# EAGLE schematic SAME54-board (EAGLE 9.6.2)

## Sheet 1 of 2
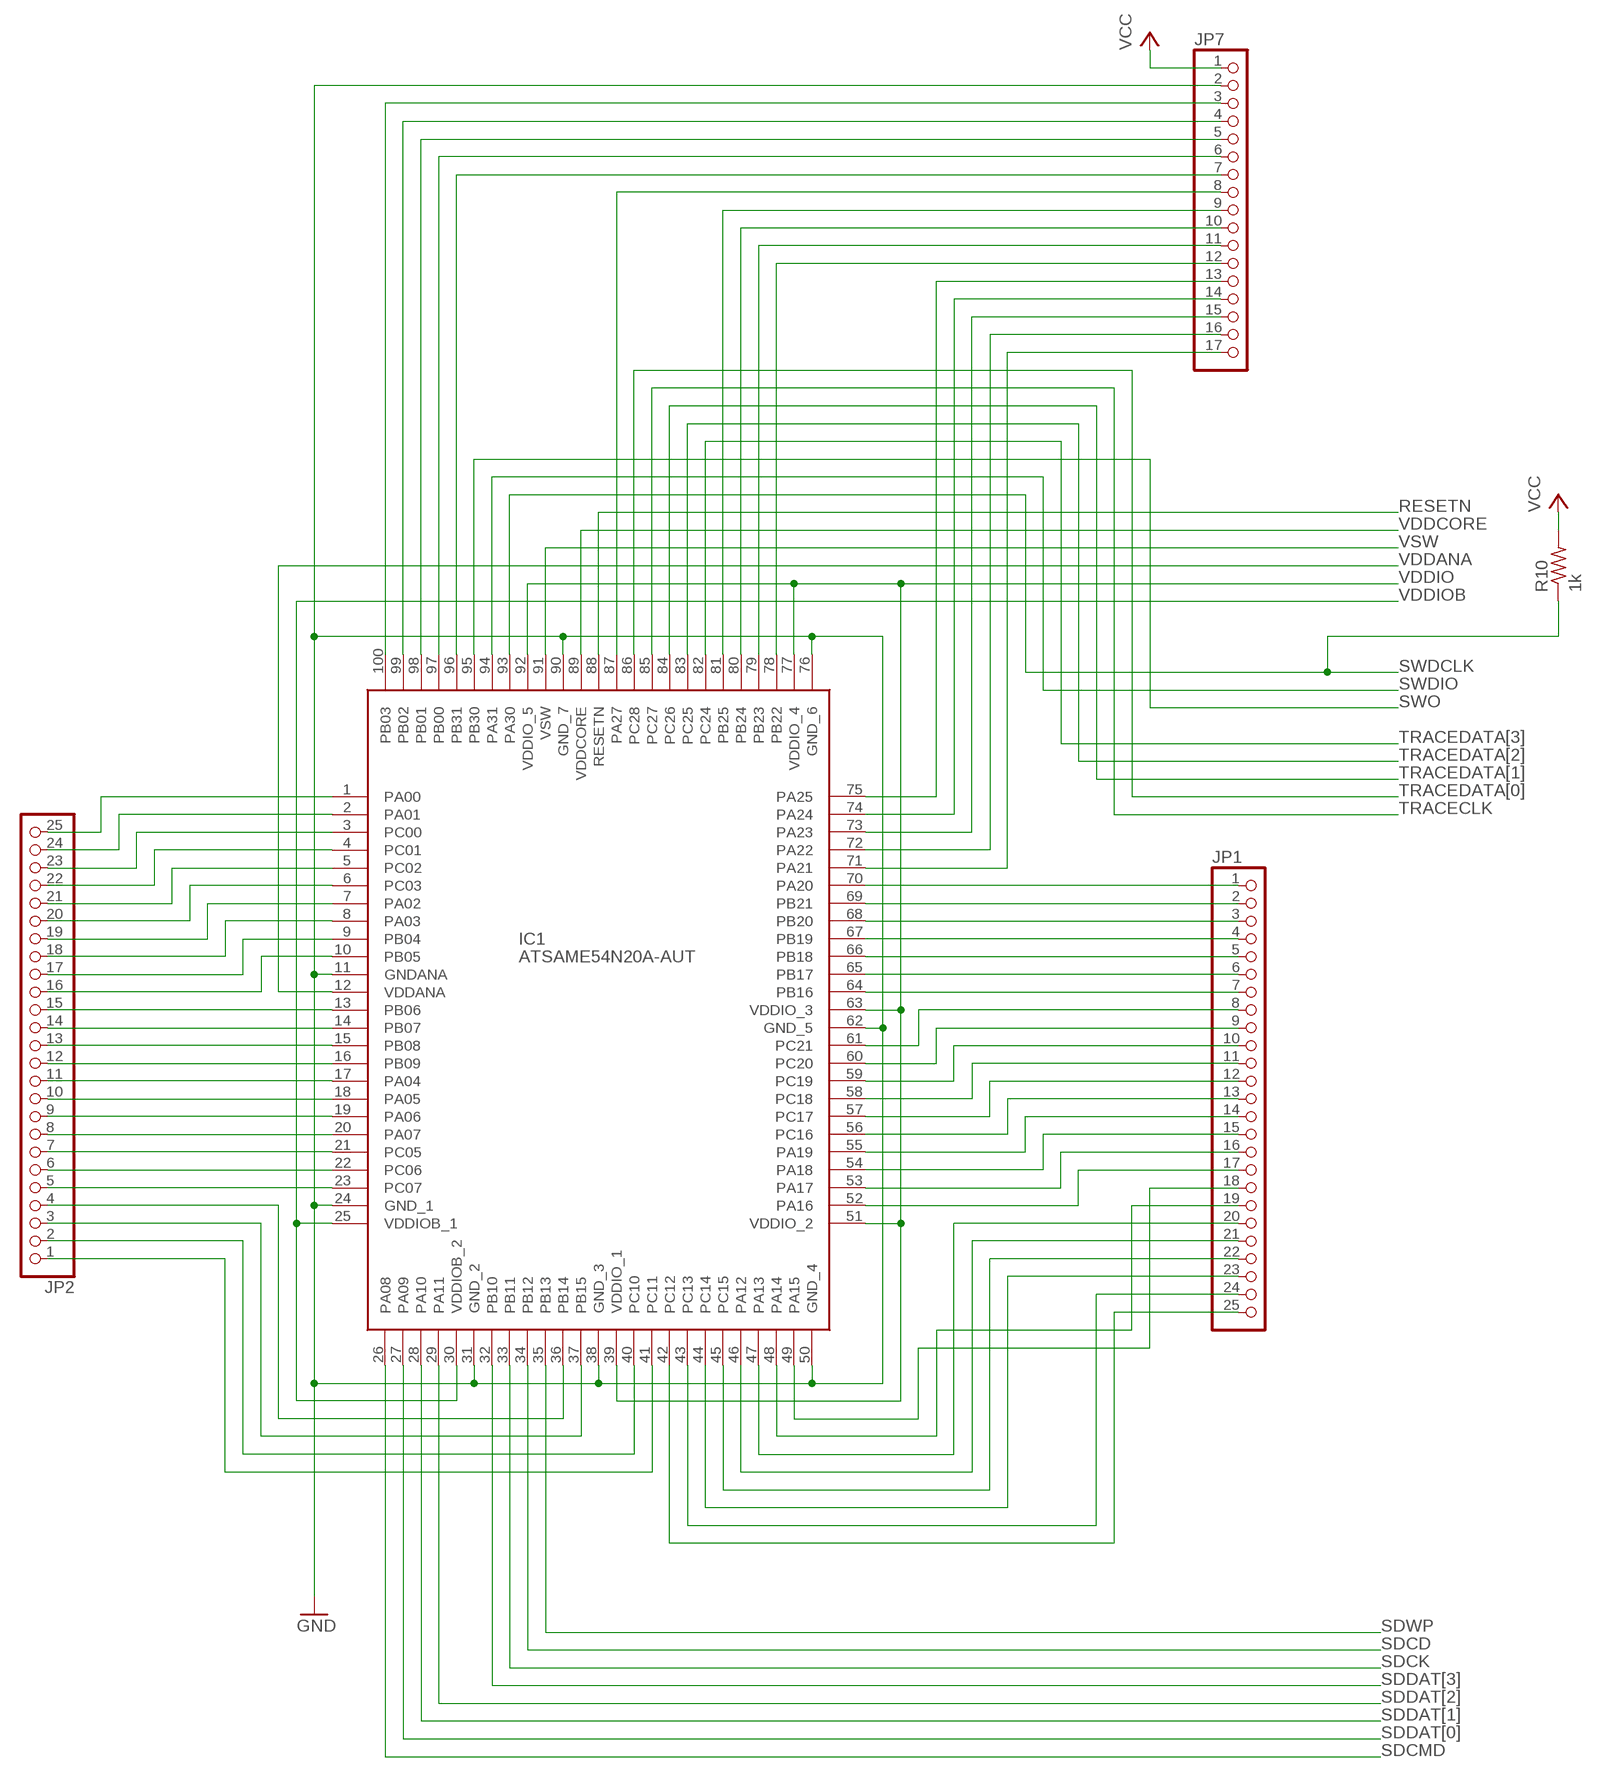
[diagram p0: schematic, sheet 1]

### Parts
IC1  ATSAME54N20A-AUT  [QFP50P1600X1600X120-100N]
JP1  PINHD-1X25  [1X25]
JP2  PINHD-1X25  [1X25]
JP7  PINHD-1X17  [1X17]
R10  1k  R-US_M1206  [M1206]

### Nets
GND: IC1.11(GNDANA) IC1.24(GND_1) IC1.31(GND_2) IC1.38(GND_3) IC1.50(GND_4) IC1.62(GND_5) IC1.76(GND_6) IC1.90(GND_7) JP7.2 ; also sheet 2
N$1: IC1.23(PC07) JP2.5
N$3: IC1.22(PC06) JP2.6
N$5: IC1.21(PC05) JP2.7
N$6: IC1.20(PA07) JP2.8
N$8: IC1.19(PA06) JP2.9
N$9: IC1.18(PA05) JP2.10
N$10: IC1.17(PA04) JP2.11
N$11: IC1.16(PB09) JP2.12
N$12: IC1.15(PB08) JP2.13
N$13: IC1.14(PB07) JP2.14
N$14: IC1.13(PB06) JP2.15
N$15: IC1.10(PB05) JP2.16
N$16: IC1.9(PB04) JP2.17
N$17: IC1.8(PA03) JP2.18
N$18: IC1.7(PA02) JP2.19
N$19: IC1.6(PC03) JP2.20
N$20: IC1.5(PC02) JP2.21
N$21: IC1.4(PC01) JP2.22
N$22: IC1.3(PC00) JP2.23
N$23: IC1.2(PA01) JP2.24
N$26: IC1.73(PA23) JP7.15
N$29: IC1.70(PA20) JP1.1
N$30: IC1.69(PB21) JP1.2
N$31: IC1.68(PB20) JP1.3
N$32: IC1.67(PB19) JP1.4
N$33: IC1.66(PB18) JP1.5
N$34: IC1.65(PB17) JP1.6
N$35: IC1.64(PB16) JP1.7
N$36: IC1.61(PC21) JP1.8
N$37: IC1.60(PC20) JP1.9
N$38: IC1.59(PC19) JP1.10
N$39: IC1.58(PC18) JP1.11
N$40: IC1.57(PC17) JP1.12
N$41: IC1.56(PC16) JP1.13
N$42: IC1.55(PA19) JP1.14
N$43: IC1.54(PA18) JP1.15
N$44: IC1.53(PA17) JP1.16
N$45: IC1.52(PA16) JP1.17
N$46: IC1.49(PA15) JP1.18
N$47: IC1.48(PA14) JP1.19
N$48: IC1.41(PC11) JP2.1
N$49: IC1.47(PA13) JP1.20
N$50: IC1.46(PA12) JP1.21
N$51: IC1.45(PC15) JP1.22
N$52: IC1.44(PC14) JP1.23
N$53: IC1.43(PC13) JP1.24
N$54: IC1.42(PC12) JP1.25
N$55: IC1.40(PC10) JP2.2
N$56: IC1.37(PB15) JP2.3
N$57: IC1.36(PB14) JP2.4
N$58: IC1.1(PA00) JP2.25
PA21: IC1.71(PA21) JP7.17
PA22: IC1.72(PA22) JP7.16
PA24: IC1.74(PA24) JP7.14
PA25: IC1.75(PA25) JP7.13
PA27: IC1.87(PA27) JP7.8
PB0: IC1.97(PB00) JP7.6
PB1: IC1.98(PB01) JP7.5
PB2: IC1.99(PB02) JP7.4
PB3: IC1.100(PB03) JP7.3
PB22: IC1.78(PB22) JP7.12
PB23: IC1.79(PB23) JP7.11
PB24: IC1.80(PB24) JP7.10
PB25: IC1.81(PB25) JP7.9
PB31: IC1.96(PB31) JP7.7
RESETN: IC1.88(RESETN) ; also sheet 2
SDCD: IC1.34(PB12) ; also sheet 2
SDCK: IC1.33(PB11) ; also sheet 2
SDCMD: IC1.26(PA08)
SDDAT[0]: IC1.27(PA09) ; also sheet 2
SDDAT[1]: IC1.28(PA10) ; also sheet 2
SDDAT[2]: IC1.29(PA11) ; also sheet 2
SDDAT[3]: IC1.32(PB10) ; also sheet 2
SDWP: IC1.35(PB13) ; also sheet 2
SWDCLK: IC1.93(PA30) R10.1 ; also sheet 2
SWDIO: IC1.94(PA31) ; also sheet 2
SWO: IC1.95(PB30) ; also sheet 2
TRACECLK: IC1.85(PC27) ; also sheet 2
TRACEDATA[0]: IC1.86(PC28) ; also sheet 2
TRACEDATA[1]: IC1.84(PC26) ; also sheet 2
TRACEDATA[2]: IC1.83(PC25) ; also sheet 2
TRACEDATA[3]: IC1.82(PC24) ; also sheet 2
VCC: JP7.1 R10.2 ; also sheet 2
VDDANA: IC1.12(VDDANA) ; also sheet 2
VDDCORE: IC1.89(VDDCORE) ; also sheet 2
VDDIO: IC1.39(VDDIO_1) IC1.51(VDDIO_2) IC1.63(VDDIO_3) IC1.77(VDDIO_4) IC1.92(VDDIO_5) ; also sheet 2
VDDIOB: IC1.25(VDDIOB_1) IC1.30(VDDIOB_2) ; also sheet 2
VSW: IC1.91(VSW) ; also sheet 2

## Sheet 2 of 2
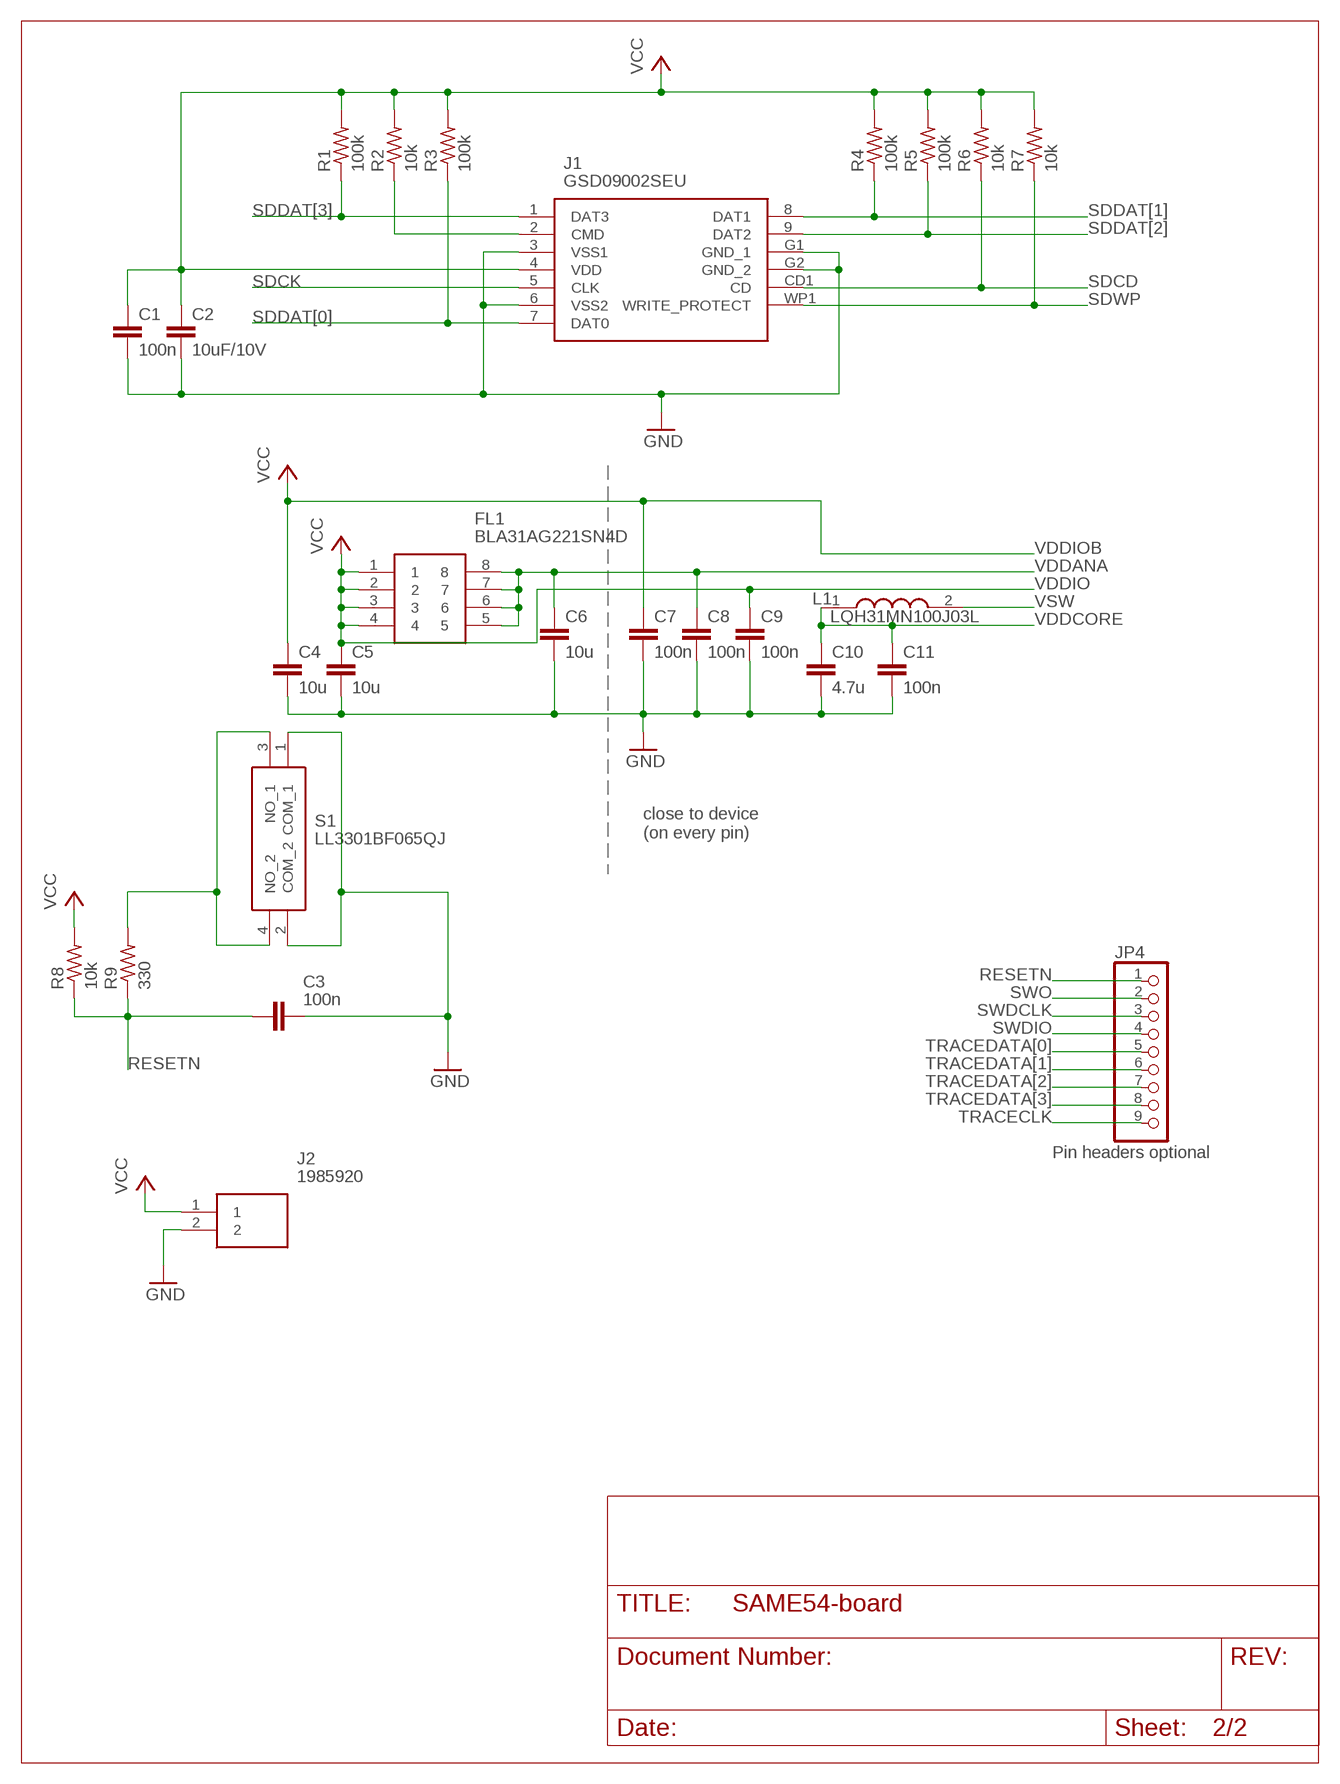
[diagram p1: schematic, sheet 2]

### Parts
C1  100n  C-EUC1206  [C1206]
C2  10uF/10V  C-EUC1206  [C1206]
C3  100n  C-EUC1206  [C1206]
C4  10u  C-EUC1206  [C1206]
C5  10u  C-EUC1206  [C1206]
C6  10u  C-EUC1206  [C1206]
C7  100n  C-EUC1206  [C1206]
C8  100n  C-EUC1206  [C1206]
C9  100n  C-EUC1206  [C1206]
C10  4.7u  C-EUC1206  [C1206]
C11  100n  C-EUC1206  [C1206]
FL1  BLA31AG221SN4D  [BLA31AG102SN4D]
J1  GSD09002SEU  [GSD09002SEU]
J2  1985920  [SHDR2W110P0X500_1X2_1000X950X1]
JP4  PINHD-1X9  [1X09]
L1  LQH31MN100J03L  [LQH31CN100K03L]
R1  100k  R-US_M1206  [M1206]
R2  10k  R-US_M1206  [M1206]
R3  100k  R-US_M1206  [M1206]
R4  100k  R-US_M1206  [M1206]
R5  100k  R-US_M1206  [M1206]
R6  10k  R-US_M1206  [M1206]
R7  10k  R-US_M1206  [M1206]
R8  10k  R-US_M1206  [M1206]
R9  330  R-US_M1206  [M1206]
S1  LL3301BF065QJ  [LL3301BF065QJ]

### Nets
GND: C1.2 C2.2 C3.2 C4.2 C5.2 C6.2 C7.2 C8.2 C9.2 C10.2 C11.2 J1.3(VSS1) J1.6(VSS2) J1.G1(GND_1) J1.G2(GND_2) J2.2 S1.1(COM_1) S1.2(COM_2) ; also sheet 1
N$2: J1.2(CMD) R2.1
N$4: R9.2 S1.3(NO_1) S1.4(NO_2)
RESETN: C3.1 JP4.1 R8.1 R9.1 ; also sheet 1
SDCD: J1.CD1(CD) R6.1 ; also sheet 1
SDCK: J1.5(CLK) ; also sheet 1
SDDAT[0]: J1.7(DAT0) R3.1 ; also sheet 1
SDDAT[1]: J1.8(DAT1) R4.1 ; also sheet 1
SDDAT[2]: J1.9(DAT2) R5.1 ; also sheet 1
SDDAT[3]: J1.1(DAT3) R1.1 ; also sheet 1
SDWP: J1.WP1(WRITE_PROTECT) R7.1 ; also sheet 1
SWDCLK: JP4.3 ; also sheet 1
SWDIO: JP4.4 ; also sheet 1
SWO: JP4.2 ; also sheet 1
TRACECLK: JP4.9 ; also sheet 1
TRACEDATA[0]: JP4.5 ; also sheet 1
TRACEDATA[1]: JP4.6 ; also sheet 1
TRACEDATA[2]: JP4.7 ; also sheet 1
TRACEDATA[3]: JP4.8 ; also sheet 1
VCC: C1.1 C2.1 J1.4(VDD) J2.1 R1.2 R2.2 R3.2 R4.2 R5.2 R6.2 R7.2 R8.2 ; also sheet 1
VDDANA: C6.1 C8.1 FL1.5 FL1.6 FL1.7 FL1.8 ; also sheet 1
VDDCORE: C10.1 C11.1 L1.1 ; also sheet 1
VDDIO: C5.1 C9.1 FL1.1 FL1.2 FL1.3 FL1.4 ; supply symbol labelled VCC ; also sheet 1
VDDIOB: C4.1 C7.1 ; supply symbol labelled VCC ; also sheet 1
VSW: L1.2 ; also sheet 1

### Notes on the sheet
- close to device
  (on every pin)
- Pin headers optional

## Library data of the parts
C1-C11 = rcl:C-EU: CAPACITOR, European symbol; SPICEPREFIX: C
FL1 = SamacSys_Parts:BLA31AG221SN4D: Murata Power Solutions Ferrite Bead, 3.2 x 1.6 x 0.8mm (3216), 220 impedance at 100 MHz Source: Datasheet <https://componentsearchengine.com/Datasheets/1/BLA31AG221SN4D.pdf>; DESCRIPTION: Murata Power Solutions Ferrite Bead, 3.2 x 1.6 x 0.8mm (3216), 220 impedance at 100 MHz; HEIGHT: 1mm; MANUFACTURER_NAME: Murata Electronics; MANUFACTURER_PART_NUMBER: BLA31AG221SN4D; MOUSER_PART_NUMBER: 81-BLA31AG221SN4D; MOUSER_PRICE-STOCK: https://www.mouser.com/Search/Refine.aspx?Keyword=81-BLA31AG221SN4D
IC1 = SamacSys_Parts:ATSAME54N20A-AUT: ARM Microcontrollers - MCU 120MHZ 1024KB FLASH 100 TQFP PKG IN 85C Source: Datasheet <https://www.mouser.com/ds/2/268/60001507A-1130176.pdf>; DESCRIPTION: ARM Microcontrollers - MCU 120MHZ 1024KB FLASH 100 TQFP PKG IN 85C; HEIGHT: 1.2mm; MANUFACTURER_NAME: Microchip; MANUFACTURER_PART_NUMBER: ATSAME54N20A-AUT; MOUSER_PART_NUMBER: 556-ATSAME54N20AAUT; MOUSER_PRICE-STOCK: https://www.mouser.co.uk/ProductDetail/Microchip-Technology/ATSAME54N20A-AUT?qs=HXFqYaX1Q2wziE5NRG3J9w%3D%3D
J1 = SamacSys_Parts:GSD09002SEU: Memory Card Connectors SD, 9 pos, 15U Source: Datasheet <https://www.arrow.com/en/products/gsd09002seu/amphenol>; DESCRIPTION: Memory Card Connectors SD, 9 pos, 15U; HEIGHT: 2.75mm; MANUFACTURER_NAME: Amphenol; MANUFACTURER_PART_NUMBER: GSD09002SEU; MOUSER_PART_NUMBER: 523-GSD09002SEU; MOUSER_PRICE-STOCK: https://www.mouser.co.uk/ProductDetail/Amphenol-Commercial-Products/GSD09002SEU?qs=J%2Fw1naXNy4LtG6w9y13mdQ%3D%3D
J2 = SamacSys_Parts:1985920: Fixed Terminal Blocks MKDSN 2.5/ 2 HT BK Source: Datasheet <https://componentsearchengine.com/Datasheets/1/1985920.pdf>; DESCRIPTION: Fixed Terminal Blocks MKDSN 2.5/ 2 HT BK; HEIGHT: 15.15mm; MANUFACTURER_NAME: Phoenix Contact; MANUFACTURER_PART_NUMBER: 1985920; MOUSER_PART_NUMBER: 651-1985920; MOUSER_PRICE-STOCK: https://www.mouser.com/Search/Refine.aspx?Keyword=651-1985920
JP1 JP2 = pinhead:PINHD-1X25: PIN HEADER
JP4 = pinhead:PINHD-1X9: PIN HEADER
JP7 = pinhead:PINHD-1X17: PIN HEADER
L1 = SamacSys_Parts:LQH31MN100J03L: Murata LQH31MN Series Wire-wound SMD Inductor 10 uH +/-5% 100mA Idc Q:35 Source: Datasheet <https://psearch.en.murata.com/inductor/product/LQH31MN100J03#.html>; DESCRIPTION: Murata LQH31MN Series Wire-wound SMD Inductor 10 uH +/-5% 100mA Idc Q:35; HEIGHT: 2mm; MANUFACTURER_NAME: Murata Electronics; MANUFACTURER_PART_NUMBER: LQH31MN100J03L; MOUSER_PART_NUMBER: 81-LQH31MN100J03L; MOUSER_PRICE-STOCK: https://www.mouser.co.uk/ProductDetail/Murata-Electronics/LQH31MN100J03L?qs=nr3D09lmWEs2Q3QeLFujyQ%3D%3D
R1-R10 = rcl:R-US_: RESISTOR, American symbol; SPICEPREFIX: R
S1 = SamacSys_Parts:LL3301BF065QJ: Pushbutton Switches 50mA 12VDC F065 9.5mm J-Lead Source: Datasheet <http://spec_sheets.e-switch.com/specs/P010455.pdf>; DESCRIPTION: Pushbutton Switches 50mA 12VDC F065 9.5mm J-Lead; HEIGHT: 9.8mm; MANUFACTURER_NAME: E-Switch; MANUFACTURER_PART_NUMBER: LL3301BF065QJ; MOUSER_PART_NUMBER: 612-LL3301BF065QJ; MOUSER_PRICE-STOCK: https://www.mouser.co.uk/ProductDetail/E-Switch/LL3301BF065QJ?qs=QtyuwXswaQgf5j8qoJZz7w%3D%3D